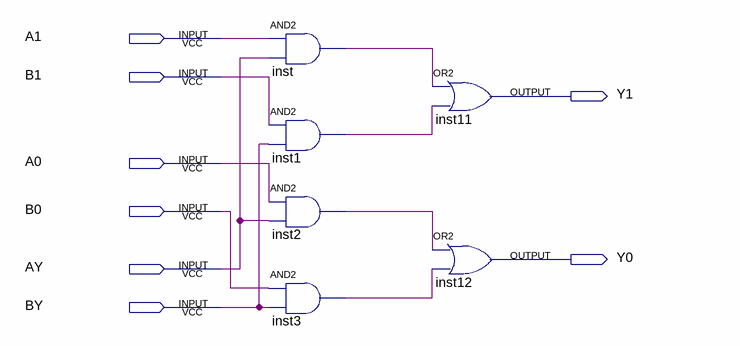
[diagram p0: schematic sheet]
// Quartus schematic selector-2bit.bdf as structural Verilog: 6 symbols, 8 pins
module \selector-2bit  (
  input  A1,
  input  B1,
  input  A0,
  input  B0,
  input  AY,
  input  BY,
  output Y1,
  output Y0
);

  wire inst1_out, inst2_out, inst3_out, inst_out;

  and inst (inst_out, A1, AY);
  and inst1 (inst1_out, B1, BY);
  and inst2 (inst2_out, A0, AY);
  and inst3 (inst3_out, B0, BY);
  or inst11 (Y1, inst_out, inst1_out);
  or inst12 (Y0, inst2_out, inst3_out);
endmodule
